# Altium schematic sheet 05 - Gate Drivers.SchDoc: Gate Drivers - 25kW WolfPACK FM3 Six-Pack Inv. (part 2 of 2)
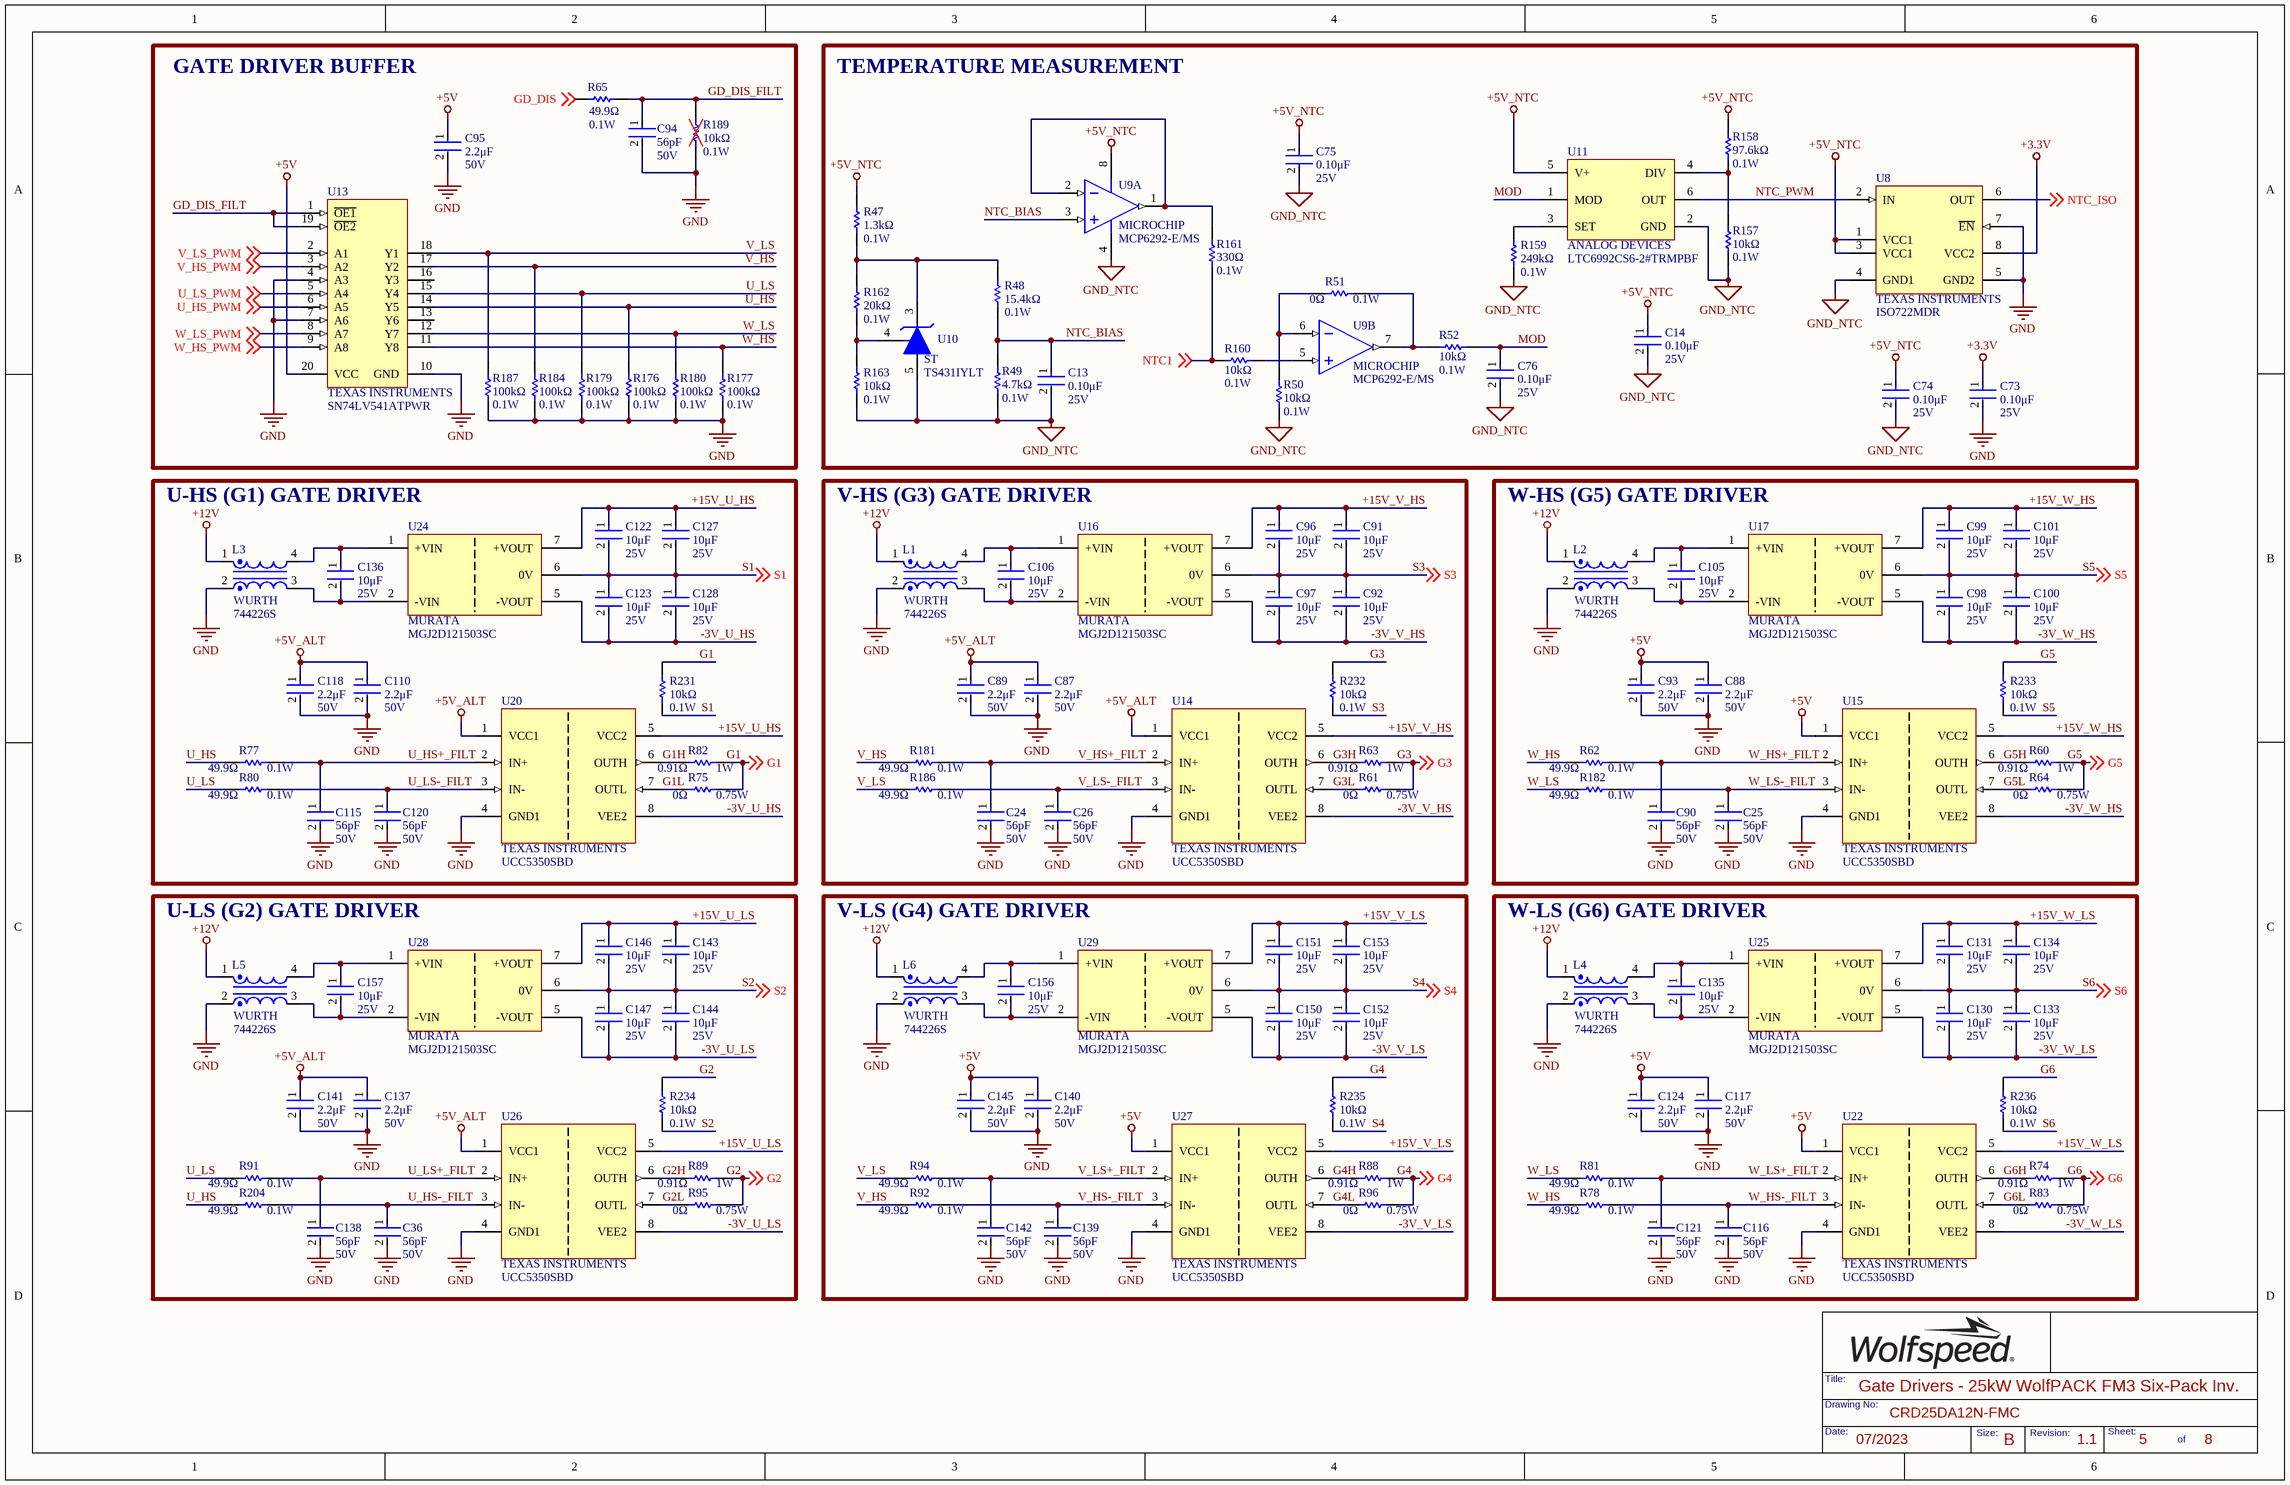
[diagram p1: 05 - Gate Drivers.SchDoc]

## Library data of the parts
C13 C14 C73-C76 = CMP-2006-03057-2: CAP CER 0.1UF 25V X7R 0603; Manufacturer: KEMET; Value: 0.10μF; Material: Ceramic; Tolerance: 0.1; Temperature Coefficient: 30ppm/°C; Automotive Grade: Grade 1; Lead Free: Yes; Device Class L3: Ceramic Capacitors; Manufacturer Part Number: C0603C104K3RACTU; Digikey Description: CAP CER 0.1UF 25V X7R 0603; Mouser Description: Multilayer Ceramic Capacitors MLCC - SMD/SMT 25volts 0.1uF X7R 10%; Package: 0603; Temperature Range Low: -55°C; Automotive: Yes; Device Class L2: Capacitors; Octopart: https://octopart.com/c0603c104k3ractu-kemet-127541; ComponentLink2Description: Datasheet; ComponentLink2URL: https://api.kemet.com/component-edge/download/datasheet/C0603C100J5GACAUTO.pdf; Temperature Range High: +125°C; RoHS: TRUE; Device Class L1: Passive Components; Category: Cap; Temperature: -55°C to +125°C; Height: 0.87mm; Temperature Characteristic: X7R
C24-C26 C36 C90 C94 C115 C116 C120 C121 C138 C139 C142 = CL10C560JB8NNNC: CAP CER 56PF 50V C0G/NP0 0603; Manufacturer: SAMSUNG; Material: Ceramic; Tolerance: 5%; Dielectric: C0G; Temperature Coefficient: 30ppm/°C; Supplier 1: Arrow Electronics; Manufacturer Part Number: CL10C560JB8NNNC; RoHS: Yes; Category: Ceramic Capacitors; Stock 1: 60182; Pricing 1: 1=0.05960, 10=0.01370, 25=0.01360, 100=0.01080, 250=0.01070, 500=0.00740, 1000=0.00590, 3000=0.00560, 6000=0.00530, 15000=0.00500, 30000=0.00470 (USD); Mount: Surface Mount; Case Code (Metric): 1608; Case Code (Imperial): 0603; Min Operating Temperature: -55°C; Max Operating Temperature: 125°C; Packaging: Tape and Reel; Package Quantity: 1; Voltage: 50V; Voltage Rating (DC): 50V; Series: CL; Construction: Flat; Termination: SMD/SMT; Length: 1.6mm; Width: 0.031inch; Height: 0.8mm; Thickness: 0.035inch; Depth: 0.8mm; Radiation Hardening: No; Lead Free: Lead Free; RoHS Compliant: Yes; ComponentLink1URL: https://datasheet.ciiva.com/25803/cl10c560jb8nnnc-25803592.pdf?src-supplier=Digi-Key; ComponentLink1Description: https://datasheet.ciiva.com/25803/cl10c560jb8nnnc-25803592.pdf?src-supplier=Digi-Key; ComponentLink2URL: https://datasheet.ciiva.com/26838/getdatasheetpartid-640760-26838546.pdf?src-supplier=Verical; ComponentLink2Description: https://datasheet.ciiva.com/26838/getdatasheetpartid-640760-26838546.pdf?src-supplier=Verical; ComponentLink3URL: https://datasheet.ciiva.com/29198/456837-da-01-en-vs-kondensator-0603-29198873.pdf?src-supplier=Conrad; ComponentLink3Description: https://datasheet.ciiva.com/29198/456837-da-01-en-vs-kondensator-0603-29198873.pdf?src-supplier=Conrad; ComponentLink4URL: https://datasheet.ciiva.com/48428/mlcc-catalogdownload2013-eng-48428598.pdf?src-supplier=Distrelec; ComponentLink4Description: https://datasheet.ciiva.com/48428/mlcc-catalogdownload2013-eng-48428598.pdf?src-supplier=Distrelec; ComponentLink5URL: https://datasheet.ciiva.com/16449/cl05b104kq5nnnc-16449527.pdf?src-supplier=Future+Electronics; ComponentLink5Description: https://datasheet.ciiva.com/16449/cl05b104kq5nnnc-16449527.pdf?src-supplier=Future+Electronics; Supplier Part Number 1: CL10C560JB8NNNC; Package: 0603; Value: 56pF
C87-C89 C93 C95 C110 C117 C118 C124 C137 C140 C141 C145 = GRT188R61H225ME13D: CAP CER 2.2UF 50V X5R 0603; Manufacturer: MURATA; Tolerance: 20%; Value: 2.2μF; Supplier 1: Arrow Electronics; Manufacturer Part Number: GRT188R61H225ME13D; RoHS: Yes; Category: Ceramic Capacitors; Stock 1: 3937; Pricing 1: 1=0.29580, 10=0.20370, 25=0.18090, 100=0.12380, 250=0.12190, 500=0.10920, 1000=0.07700, 3000=0.07630 (USD); Mount: Surface Mount; Case Code (Metric): 1608; Case Code (Imperial): 0603; Min Operating Temperature: -55°C; Max Operating Temperature: 85°C; Packaging: Tape and Reel; Length: 0.063inch; Width: 0.031inch; Thickness: 0.035inch; Ratings: AEC-Q200; RoHS Compliant: Yes; ComponentLink1URL: http://search.murata.co.jp/Ceramy/image/img/A01X/G101/ENG/GRT188R61H225ME13-01.pdf?src-supplier=Digi-Key; ComponentLink1Description: http://search.murata.co.jp/Ceramy/image/img/A01X/G101/ENG/GRT188R61H225ME13-01.pdf?src-supplier=Digi-Key; ComponentLink2URL: https://search.murata.co.jp/Ceramy/image/img/A01X/G101/ENG/GRT188R61H225ME13-01.pdf?src-supplier=Digi-Key; ComponentLink2Description: https://search.murata.co.jp/Ceramy/image/img/A01X/G101/ENG/GRT188R61H225ME13-01.pdf?src-supplier=Digi-Key; Supplier Part Number 1: GRT188R61H225ME13D; Package: 0603
C91 C92 C96-C101 C105 C106 C122 C123 C127 C128 C130 C131 C133-C136 C143 C144 C146 C147 C150-C153 C156 C157 = CMP-13271-001434-1: CAP CER 10UF 25V X7R 1206; Manufacturer: SAMSUNG; Tolerance: 10%; Value: 10μF; Max Operating Temperature: 125°C; Dielectric: X7R; Min Operating Temperature: -55°C; Height: 1.6mm; Mount: Surface Mount; Width: 0.063inch; Thickness: 0.071inch; Case Code (Metric): 3216; Contact Plating: Tin; Packaging: Tape and Reel; Package: 1206; Case Code (Imperial): 1206; Length: 0.126inch; Radiation Hardening: No; Package Quantity: 1; Depth: 1.6mm; Manufacturer Part Number: CL31B106KAHSFNE
L1-L6 = 744226S: CMC 10UH 1.6A 2LN 920 OHM SMD; Manufacturer: WURTH ELECTRONIK; Tolerance: 30%; Voltage Rating: 80V; Resistance: 80mR; Impedance: 920R; Number of Lines: 2; Test Frequency: 1kHz; Value: 10μH; Supplier 1: Rs; Manufacturer Part Number: 744226S; RoHS: Yes; Category: Common Mode Chokes; Stock 1: 1; Pricing 1: 1=2.59000, 25=2.28200, 100=2.10000, 250=1.94000, 500=1.81400 (USD); Mount: Surface Mount; Case/Package: SMD/SMT; Weight: 0.017672oz; Min Operating Temperature: -40°C; Max Operating Temperature: 125°C; Packaging: Tape and Reel; Package Quantity: 1; Series: WE-SL2; Termination: SMD/SMT; Current Rating: 1.6A; Inductance: 10uH; Current: 1.6A; DC Resistance (DCR): 80mR; Max DC Current: 1.6A; Max Current Rating: 1.6A; Length: 9.2mm; Width: 6mm; Height: 0.205inch; Lead Free: Lead Free; RoHS Compliant: Yes; Reach SVHC Compliant: Yes; ComponentLink1URL: https://datasheet.ciiva.com/12378/744226s-67907-12378330.pdf?src-supplier=Mouser; ComponentLink1Description: https://datasheet.ciiva.com/12378/744226s-67907-12378330.pdf?src-supplier=Mouser; ComponentLink2URL: https://datasheet.ciiva.com/1008/744226s-1008438.pdf?src-supplier=Digi-Key; ComponentLink2Description: https://datasheet.ciiva.com/1008/744226s-1008438.pdf?src-supplier=Digi-Key; ComponentLink3URL: https://datasheet.ciiva.com/1126/1735584-1126949.pdf?src-supplier=Element14; ComponentLink3Description: https://datasheet.ciiva.com/1126/1735584-1126949.pdf?src-supplier=Element14; ComponentLink4URL: https://datasheet.ciiva.com/6868/1696373-6868167.pdf?src-supplier=Newark; ComponentLink4Description: https://datasheet.ciiva.com/6868/1696373-6868167.pdf?src-supplier=Newark; ComponentLink5URL: https://datasheet.ciiva.com/1008/744226s-1008439.pdf?src-supplier=Digi-Key; ComponentLink5Description: https://datasheet.ciiva.com/1008/744226s-1008439.pdf?src-supplier=Digi-Key; ComponentLink6URL: https://datasheet.ciiva.com/1008/744226s-1008440.pdf?src-supplier=Digi-Key; ComponentLink6Description: https://datasheet.ciiva.com/1008/744226s-1008440.pdf?src-supplier=Digi-Key; ComponentLink7URL: https://datasheet.ciiva.com/26308/744226s-eng-tds-26308764.pdf?src-supplier=Distrelec; ComponentLink7Description: https://datasheet.ciiva.com/26308/744226s-eng-tds-26308764.pdf?src-supplier=Distrelec; ComponentLink8URL: https://datasheet.ciiva.com/48691/001087362-da-01-ml-we-sl2-stromkomp-smd-line-filter-7-de-en-48691435.pdf?src-supplier=Conrad; ComponentLink8Description: https://datasheet.ciiva.com/48691/001087362-da-01-ml-we-sl2-stromkomp-smd-line-filter-7-de-en-48691435.pdf?src-supplier=Conrad; Supplier Part Number 1: 9040408; Package: 4-PC
R47 = ERA3AEB132V: RES SMD 1.3K OHM 0.1% 1/10W 0603; Manufacturer: PANASONIC; Manufacturer Part Number: ERA-3AEB132V; Temperature Coefficient: 25ppm/°C; Voltage Rating: 75V; Max Power Dissipation: 100mW; Value: 1.3kΩ; Supplier 1: Arrow Electronics; RoHS: Yes; Category: Chip SMD Resistors; Stock 1: 2183; Pricing 1: 1=0.31630, 10=0.27230, 25=0.26980, 100=0.11100, 250=0.10990, 500=0.06700, 1000=0.04610 (USD); Mount: Surface Mount; Package: 0603; Number of Pins: 2; Contact Plating: Tin; Case Code (Metric): 1608; Case Code (Imperial): 0603; Min Operating Temperature: -55°C; Max Operating Temperature: 155°C; Tolerance: 0.1%; Resistor Type: Thin Film; Packaging: Tape and Reel; Package Quantity: 1; Number of Terminations: 2; Termination: SMD/SMT; Voltage Rating (DC): 75V; Features: Automotive AEC-Q200; Series: ERA-3A; Resistance Tolerance: 0.1%; Construction: Rectangular; Technology: THIN FILM; Length: 1.6mm; Width: 0.8mm; Height: 0.45mm; Depth: 0.8mm; Ratings: AEC-Q200; Radiation Hardening: No; Reach SVHC Compliant: Yes; Military Standard: Not; Lead Free: Lead Free; RoHS Compliant: Yes; ComponentLink1URL: https://datasheet.ciiva.com/29183/450807-da-01-en-widerstand-0603-era-29183761.pdf?src-supplier=Conrad; ComponentLink1Description: https://datasheet.ciiva.com/29183/450807-da-01-en-widerstand-0603-era-29183761.pdf?src-supplier=Conrad; ComponentLink2URL: https://datasheet.ciiva.com/6001/485442-6001669.pdf?src-supplier=Farnell; ComponentLink2Description: https://datasheet.ciiva.com/6001/485442-6001669.pdf?src-supplier=Farnell; ComponentLink3URL: https://datasheet.ciiva.com/6001/485442-6001671.pdf?src-supplier=Farnell; ComponentLink3Description: https://datasheet.ciiva.com/6001/485442-6001671.pdf?src-supplier=Farnell; ComponentLink4URL: https://datasheet.ciiva.com/48530/era-eng-tds-48530511.pdf?src-supplier=Distrelec; ComponentLink4Description: https://datasheet.ciiva.com/48530/era-eng-tds-48530511.pdf?src-supplier=Distrelec; ComponentLink5URL: https://datasheet.ciiva.com/48425/era-eng-tds-48425420.pdf?src-supplier=Distrelec; ComponentLink5Description: https://datasheet.ciiva.com/48425/era-eng-tds-48425420.pdf?src-supplier=Distrelec; ComponentLink6URL: https://datasheet.ciiva.com/24069/aoa0000ce26-197354-24069145.pdf?src-supplier=Mouser; ComponentLink6Description: https://datasheet.ciiva.com/24069/aoa0000ce26-197354-24069145.pdf?src-supplier=Mouser; ComponentLink7URL: https://datasheet.ciiva.com/30069/54aoa0000ce26-30069735.pdf?src-supplier=Onlinecomponents.com; ComponentLink7Description: https://datasheet.ciiva.com/30069/54aoa0000ce26-30069735.pdf?src-supplier=Onlinecomponents.com; Supplier Part Number 1: ERA-3AEB132V
R48 = RC1608F1542CS: RES SMD 15.4K OHM 1% 1/10W 0603; Manufacturer: SAMSUNG; Max Power Dissipation: 100mW; Temperature Coefficient: 100ppm/°C; Voltage Rating (DC): 50V; Value: 15.4kΩ; Supplier 1: Arrow Electronics; Manufacturer Part Number: RC1608F1542CS; RoHS: Yes; Category: Chip SMD Resistors; Stock 1: 200612; Pricing 1: 1=0.01730, 10=0.01350, 25=0.01280, 50=0.01230, 100=0.01180, 250=0.01140, 500=0.01090, 1000=0.01050, 3000=0.01000, 6000=0.00950, 15000=0.00910, 30000=0.00860, 75000=0.00820 (USD); Package: 0603; Case Code (Metric): 1608; Case Code (Imperial): 0603; Contact Plating: Tin; Min Operating Temperature: -55°C; Max Operating Temperature: 155°C; Tolerance: 1%; Packaging: Tape and Reel; Resistor Type: Thick Film; Package Quantity: 1; Number of Terminations: 2; Features: Moisture Resistant; Series: RC; Length: 0.063inch; Width: 0.031inch; Height: 0.022inch; Radiation Hardening: No; Lead Free: Lead Free; RoHS Compliant: Yes; ComponentLink1URL: https://datasheet.ciiva.com/26333/451155-da-01-en-widerstand-0603-26333685.pdf?src-supplier=Conrad; ComponentLink1Description: https://datasheet.ciiva.com/26333/451155-da-01-en-widerstand-0603-26333685.pdf?src-supplier=Conrad; Supplier Part Number 1: RC1608F1542CS
R49 = CRCW06034K70FKTA: RES SMD 4.7K OHM 1% 1/10W 0603; Manufacturer: VISHAY DALE; Voltage Rating: 75V; Max Power Dissipation: 100mW; Temperature Coefficient: 100ppm/°C; Value: 4.7kΩ; Supplier 1: Digi-Key; Manufacturer Part Number: CRCW06034K70FKTA; RoHS: No; Category: Chip SMD Resistors; Pricing 1: 1=0.15000, 10=0.12900, 100=0.05040, 1000=0.02111, 2500=0.01936 (USD); Package: 0603; Weight: 7.1E-05oz; Case Code (Metric): 1608; Case Code (Imperial): 0603; Contact Plating: Tin,Lead; Min Operating Temperature: -55°C; Max Operating Temperature: 155°C; Tolerance: 1%; Resistor Type: Thick Film; Package Quantity: 5000; Packaging: Tape and Reel; Number of Terminations: 2; Voltage Rating (DC): 75V; Power Dissipation: 100mW; Features: Automotive AEC-Q200; Series: CRCW; Construction: Rectangular; Length: 1.55mm; Width: 0.033inch; Height: 0.02inch; Depth: 0.85mm; Radiation Hardening: No; Lead Free: Contains Lead; Military Standard: Not; RoHS Compliant: No; ComponentLink1URL: https://datasheet.ciiva.com/9071/dcrcw-9071351.pdf?src-supplier=Avnet; ComponentLink1Description: https://datasheet.ciiva.com/9071/dcrcw-9071351.pdf?src-supplier=Avnet; ComponentLink2URL: https://datasheet.ciiva.com/2565/dcrcw-2565426.pdf?src-supplier=Digi-Key; ComponentLink2Description: https://datasheet.ciiva.com/2565/dcrcw-2565426.pdf?src-supplier=Digi-Key; Supplier Part Number 1: 541-3004-6-ND
R50 R52 R157 R160 R163 R189 R231-R236 = ERJ3EKF1002V: RES SMD 10K OHM 1% 1/10W 0603; Manufacturer: PANASONIC; Manufacturer Part Number: ERJ-3EKF1002V; Temperature Coefficient: 100ppm/°C; Power Rating: 100mW; Voltage Rating: 75V; Value: 10kΩ; Supplier 1: Rs; RoHS: Yes; Category: Chip SMD Resistors; Stock 1: 10000; Mount: Surface Mount; Package: 0603; Number of Pins: 2; Contact Plating: Tin; Case Code (Metric): 1608; Case Code (Imperial): 0603; Size Code: 0603; Min Operating Temperature: -55°C; Max Operating Temperature: 155°C; Tolerance: 1%; Resistor Type: Thick Film; Packaging: Tape and Reel; Package Quantity: 1; Number of Terminations: 2; Termination: SMD/SMT; Voltage Rating (DC): 75V; Features: Automotive AEC-Q200; Series: ERJ; Technology: THICK FILM; Resistance Tolerance: 1%; Construction: Rectangular; Length: 1.6mm; Width: 0.8mm; Height: 0.45mm; Depth: 0.8mm; Radiation Hardening: No; Reach SVHC Compliant: Yes; Military Standard: Not; Lead Free: Lead Free; RoHS Compliant: Yes; ComponentLink1URL: https://datasheet.ciiva.com/7830/aoa0000ce2-7830729.pdf?src-supplier=Element14; ComponentLink1Description: https://datasheet.ciiva.com/7830/aoa0000ce2-7830729.pdf?src-supplier=Element14; ComponentLink2URL: https://datasheet.ciiva.com/46372/1678782-46372725.pdf?src-supplier=Element14; ComponentLink2Description: https://datasheet.ciiva.com/46372/1678782-46372725.pdf?src-supplier=Element14; ComponentLink3URL: https://datasheet.ciiva.com/28514/426256-28514198.pdf?src-supplier=Element14; ComponentLink3Description: https://datasheet.ciiva.com/28514/426256-28514198.pdf?src-supplier=Element14; ComponentLink4URL: https://datasheet.ciiva.com/24070/aoa0000ce2-24070318.pdf?src-supplier=Mouser; ComponentLink4Description: https://datasheet.ciiva.com/24070/aoa0000ce2-24070318.pdf?src-supplier=Mouser; ComponentLink5URL: https://datasheet.ciiva.com/16759/70260748-16759807.pdf?src-supplier=Allied+Electronics; ComponentLink5Description: https://datasheet.ciiva.com/16759/70260748-16759807.pdf?src-supplier=Allied+Electronics; ComponentLink6URL: https://datasheet.ciiva.com/9194/aoa0000ce2-9194199.pdf?src-supplier=Avnet; ComponentLink6Description: https://datasheet.ciiva.com/9194/aoa0000ce2-9194199.pdf?src-supplier=Avnet; ComponentLink7URL: https://datasheet.ciiva.com/48530/aoa0000ce2-48530988.pdf?src-supplier=Avnet; ComponentLink7Description: https://datasheet.ciiva.com/48530/aoa0000ce2-48530988.pdf?src-supplier=Avnet; ComponentLink8URL: https://datasheet.ciiva.com/30208/aoa0000ce2-30208985.pdf?src-supplier=Onlinecomponents.com; ComponentLink8Description: https://datasheet.ciiva.com/30208/aoa0000ce2-30208985.pdf?src-supplier=Onlinecomponents.com; Supplier Part Number 1: 1051156
R51 = CRCW06030000Z0EB: RES SMD 0 OHM JUMPER 1/10W 0603; Manufacturer: VISHAY DALE; Manufacturer Part Number: CRCW06030000Z0EBC; Max Power Dissipation: 100mW; Voltage Rating: 75V; Tolerance: 1%; Temperature Coefficient: 100ppm/°C; Value: 0Ω; Supplier 1: Newark; RoHS: Yes; Category: Chip SMD Resistors; Stock 1: 110000; Pricing 1: 1=0.00300, 10000=0.00300 (USD); Package: 0603; Number of Pins: 2; Case Code (Imperial): 0603; Case Code (Metric): 1608; Weight: 7.1E-05oz; Contact Plating: Tin; Size Code: 0603; Min Operating Temperature: -55°C; Max Operating Temperature: 155°C; Packaging: Tape and Reel; Resistor Type: Thick Film; Number of Terminations: 2; Features: Automotive AEC-Q200; Package Quantity: 10000; Termination: SMD/SMT; Voltage Rating (DC): 75V; Series: CRCW; Construction: Rectangular; Technology: THICK FILM; Length: 1.55mm; Width: 0.033inch; Height: 0.45mm; Depth: 0.85mm; Ratings: AEC-Q200; Radiation Hardening: No; RoHS Compliant: Yes; Lead Free: Lead Free; Military Standard: Not; ComponentLink1URL: https://datasheet.ciiva.com/11808/0900766b80d98afc-11808678.pdf?src-supplier=Rs; ComponentLink1Description: https://datasheet.ciiva.com/11808/0900766b80d98afc-11808678.pdf?src-supplier=Rs; ComponentLink2URL: https://datasheet.ciiva.com/2563/dcrcwe3-2563949.pdf?src-supplier=Digi-Key; ComponentLink2Description: https://datasheet.ciiva.com/2563/dcrcwe3-2563949.pdf?src-supplier=Digi-Key; ComponentLink3URL: https://datasheet.ciiva.com/5550/dcrcwe3-109170-5550748.pdf?src-supplier=Mouser; ComponentLink3Description: https://datasheet.ciiva.com/5550/dcrcwe3-109170-5550748.pdf?src-supplier=Mouser; ComponentLink4URL: https://datasheet.ciiva.com/16430/dcrcwe3-16430060.pdf?src-supplier=Future+Electronics; ComponentLink4Description: https://datasheet.ciiva.com/16430/dcrcwe3-16430060.pdf?src-supplier=Future+Electronics; ComponentLink5URL: https://datasheet.ciiva.com/7791/dcrcwe3-7791992.pdf?src-supplier=Element14; ComponentLink5Description: https://datasheet.ciiva.com/7791/dcrcwe3-7791992.pdf?src-supplier=Element14; Supplier Part Number 1: 48P7902
R60 R63 R74 R82 R88 R89 = CMP-2005-02198-1: RES 0.91 OHM 1% 1W 1210; Manufacturer: VISHAY DALE; Part Number: RCWE1210R910FKEA; Manufacturer Part Number: RCWE1210R910FKEA; Package: 1210
R61 R64 R75 R83 R95 R96 = CRCW12100000Z0EAHP: RES SMD 0 OHM JUMPER 3/4W 1210; Manufacturer: VISHAY DALE; Max Power Dissipation: 750mW; Supplier 1: Mouser; Manufacturer Part Number: CRCW12100000Z0EAHP; RoHS: Yes; Category: Chip SMD Resistors; Stock 1: 904; Pricing 1: 1=0.7, 10=0.535, 50=0.535, 100=0.225, 1000=0.135, 10000=0.134 (USD); Package: 1210; Weight: 0.000564oz; Case Code (Imperial): 1210; Case Code (Metric): 3225; Min Operating Temperature: -55°C; Max Operating Temperature: 155°C; Packaging: Tape and Reel; Package Quantity: 10; Resistance: 0Ω; Termination: SMD/SMT; Number of Terminations: 2; Features: Automotive AEC-Q200; Series: CRCW-HP; Length: 0.126inch; Width: 0.098inch; Height: 0.028inch; Radiation Hardening: No; Lead Free: Lead Free; RoHS Compliant: Yes; ComponentLink1URL: https://datasheet.ciiva.com/2477/crcwhpe3-2477993.pdf?src-supplier=Digi-Key; ComponentLink1Description: https://datasheet.ciiva.com/2477/crcwhpe3-2477993.pdf?src-supplier=Digi-Key; ComponentLink2URL: https://datasheet.ciiva.com/2477/crcwhpe3-2477991.pdf?src-supplier=Digi-Key; ComponentLink2Description: https://datasheet.ciiva.com/2477/crcwhpe3-2477991.pdf?src-supplier=Digi-Key; ComponentLink3URL: https://datasheet.ciiva.com/2477/crcwhpe3-2477992.pdf?src-supplier=Digi-Key; ComponentLink3Description: https://datasheet.ciiva.com/2477/crcwhpe3-2477992.pdf?src-supplier=Digi-Key; ComponentLink4URL: https://datasheet.ciiva.com/9109/crcwhpe3-9109997.pdf?src-supplier=Avnet; ComponentLink4Description: https://datasheet.ciiva.com/9109/crcwhpe3-9109997.pdf?src-supplier=Avnet; ComponentLink5URL: https://datasheet.ciiva.com/48527/crcwhpe3-48527662.pdf?src-supplier=Avnet; ComponentLink5Description: https://datasheet.ciiva.com/48527/crcwhpe3-48527662.pdf?src-supplier=Avnet; Supplier Part Number 1: 71-CRCW12100000Z0EAH
R62 R65 R77 R78 R80 R81 R91 R92 R94 R181 R182 R186 R204 = ERJ-3EKF49R9V: RES SMD 49.9 OHM 1% 1/10W 0603; Manufacturer: PANASONIC; Temperature Coefficient: 100ppm/°C; Voltage Rating: 75V; Max Power Dissipation: 100mW; Voltage Rating (DC): 50V; Working Voltage: 6V; Value: 49.9Ω; Supplier 1: Newark; Manufacturer Part Number: ERJ-3EKF49R9V; RoHS: Yes; Category: Chip SMD Resistors; Stock 1: 670000; Pricing 1: 1=0.00600, 5000=0.00600 (USD); Mount: Surface Mount; Contact Plating: Tin; Case Code (Imperial): 0603; Case Code (Metric): 1608; Min Operating Temperature: -55°C; Max Operating Temperature: 155°C; Tolerance: 1%; Resistor Type: Thick Film; Packaging: Tape and Reel; Package Quantity: 5000; Number of Terminations: 2; Termination: SMD/SMT; Features: Automotive AEC-Q200; Series: ERJ; Resistance Tolerance: 1%; Construction: Rectangular; Technology: THICK FILM; Length: 1.6mm; Width: 0.8mm; Height: 0.022inch; Depth: 0.8mm; Radiation Hardening: No; Reach SVHC Compliant: Yes; Military Standard: Not; Lead Free: Lead Free; RoHS Compliant: Yes; ComponentLink1URL: https://datasheet.ciiva.com/46388/1678782-46388908.pdf?src-supplier=Element14; ComponentLink1Description: https://datasheet.ciiva.com/46388/1678782-46388908.pdf?src-supplier=Element14; ComponentLink2URL: https://datasheet.ciiva.com/28694/1678782-28694219.pdf?src-supplier=Element14; ComponentLink2Description: https://datasheet.ciiva.com/28694/1678782-28694219.pdf?src-supplier=Element14; ComponentLink3URL: https://datasheet.ciiva.com/16772/70260748-16772570.pdf?src-supplier=Allied+Electronics; ComponentLink3Description: https://datasheet.ciiva.com/16772/70260748-16772570.pdf?src-supplier=Allied+Electronics; ComponentLink4URL: https://datasheet.ciiva.com/16766/70260748-16766262.pdf?src-supplier=Allied+Electronics; ComponentLink4Description: https://datasheet.ciiva.com/16766/70260748-16766262.pdf?src-supplier=Allied+Electronics; ComponentLink5URL: https://datasheet.ciiva.com/9117/aoa0000ce2-9117128.pdf?src-supplier=Avnet; ComponentLink5Description: https://datasheet.ciiva.com/9117/aoa0000ce2-9117128.pdf?src-supplier=Avnet; ComponentLink6URL: https://datasheet.ciiva.com/48531/aoa0000ce2-48531019.pdf?src-supplier=Avnet; ComponentLink6Description: https://datasheet.ciiva.com/48531/aoa0000ce2-48531019.pdf?src-supplier=Avnet; ComponentLink7URL: https://datasheet.ciiva.com/30095/aoa0000ce2-30095355.pdf?src-supplier=Onlinecomponents.com; ComponentLink7Description: https://datasheet.ciiva.com/30095/aoa0000ce2-30095355.pdf?src-supplier=Onlinecomponents.com; Supplier Part Number 1: 12AC1058; Package: 0603
R158 = ERJ-3EKF9762V: RES SMD 97.6K OHM 1% 1/10W 0603; Manufacturer: PANASONIC; Temperature Coefficient: 100ppm/°C; Voltage Rating: 75V; Power Rating: 100mW; Voltage Rating (DC): 50V; Value: 97.6kΩ; Supplier 1: Newark; Manufacturer Part Number: ERJ-3EKF9762V; RoHS: Yes; Category: Chip SMD Resistors; Stock 1: 50000; Pricing 1: 5000=0.01600, 10000=0.01600, 20000=0.01600, 30000=0.01600, 50000=0.01400 (USD); Mount: Surface Mount; Package: 0603; Contact Plating: Tin; Case Code (Metric): 1608; Case Code (Imperial): 0603; Min Operating Temperature: -55°C; Max Operating Temperature: 155°C; Tolerance: 1%; Resistor Type: Thick Film; Packaging: Tape and Reel; Package Quantity: 1; Number of Terminations: 2; Termination: SMD/SMT; Features: Automotive AEC-Q200; Series: ERJ; Resistance Tolerance: 1%; Construction: Rectangular; Technology: THICK FILM; Length: 1.6mm; Width: 0.8mm; Height: 0.45mm; Depth: 0.8mm; Radiation Hardening: No; Reach SVHC Compliant: Yes; Military Standard: Not; RoHS Compliant: Yes; ComponentLink1URL: https://datasheet.ciiva.com/7937/1678782-7937451.pdf?src-supplier=Element14; ComponentLink1Description: https://datasheet.ciiva.com/7937/1678782-7937451.pdf?src-supplier=Element14; ComponentLink2URL: https://datasheet.ciiva.com/46420/1678782-46420270.pdf?src-supplier=Element14; ComponentLink2Description: https://datasheet.ciiva.com/46420/1678782-46420270.pdf?src-supplier=Element14; ComponentLink3URL: https://datasheet.ciiva.com/24023/aoa0000ce2-24023438.pdf?src-supplier=Mouser; ComponentLink3Description: https://datasheet.ciiva.com/24023/aoa0000ce2-24023438.pdf?src-supplier=Mouser; ComponentLink4URL: https://datasheet.ciiva.com/16770/70260748-16770055.pdf?src-supplier=Allied+Electronics; ComponentLink4Description: https://datasheet.ciiva.com/16770/70260748-16770055.pdf?src-supplier=Allied+Electronics; ComponentLink5URL: https://datasheet.ciiva.com/16762/70260748-16762984.pdf?src-supplier=Allied+Electronics; ComponentLink5Description: https://datasheet.ciiva.com/16762/70260748-16762984.pdf?src-supplier=Allied+Electronics; ComponentLink6URL: https://datasheet.ciiva.com/9186/aoa0000ce2-9186837.pdf?src-supplier=Avnet; ComponentLink6Description: https://datasheet.ciiva.com/9186/aoa0000ce2-9186837.pdf?src-supplier=Avnet; ComponentLink7URL: https://datasheet.ciiva.com/9186/aoa0000ce2-9186841.pdf?src-supplier=Avnet; ComponentLink7Description: https://datasheet.ciiva.com/9186/aoa0000ce2-9186841.pdf?src-supplier=Avnet; Supplier Part Number 1: 27AC5274
R159 = RMCF0603FT249K: RES 249K OHM 1% 1/10W 0603; Manufacturer: STACKPOLE; Temperature Coefficient: 100ppm/°C; Value: 249kΩ; Supplier 1: Avnet; Manufacturer Part Number: RMCF0603FT249K; RoHS: Yes; Category: Chip SMD Resistors; Stock 1: 30000; Pricing 1: 5000=0.00280, 10000=0.00276, 20000=0.00272, 30000=0.00268, 40000=0.00264, 50000=0.00260, 500000=0.00256 (USD); Mount: Surface Mount; Package: 0603; Case Code (Metric): 1608; Case Code (Imperial): 0603; Contact Plating: Tin,Matte; Min Operating Temperature: -55°C; Max Operating Temperature: 155°C; Packaging: Tape and Reel; Tolerance: 1%; Series: RMCF; Resistor Type: Thick Film; Number of Terminations: 2; Features: Automotive AEC-Q200; Length: 0.061inch; Width: 0.031inch; Height: 0.022inch; Radiation Hardening: No; RoHS Compliant: Yes; Lead Free: Lead Free; ComponentLink1URL: https://www.seielect.com/catalog/SEI-Packaging.pdf?src-supplier=Digi-Key; ComponentLink1Description: https://www.seielect.com/catalog/SEI-Packaging.pdf?src-supplier=Digi-Key; ComponentLink2URL: https://www.seielect.com/Catalog/SEI-RMCF_RMCP.pdf?src-supplier=Digi-Key; ComponentLink2Description: https://www.seielect.com/Catalog/SEI-RMCF_RMCP.pdf?src-supplier=Digi-Key; ComponentLink3URL: https://www.seielect.com/catalog/SEI-RMCF_RMCP.pdf?src-supplier=Avnet; ComponentLink3Description: https://www.seielect.com/catalog/SEI-RMCF_RMCP.pdf?src-supplier=Avnet; Supplier Part Number 1: RMCF0603FT249K
R161 = RC0603FR-13330RL: RES 330 OHM 1% 1/10W 0603; Manufacturer: YAGEO; Voltage Rating: 50V; Temperature Coefficient: 100ppm/°C; Value: 330Ω; Supplier 1: Future Electronics; Manufacturer Part Number: RC0603FR-13330RL; RoHS: Yes; Category: Chip SMD Resistors; Stock 1: 560000; Pricing 1: 20000=0.00130, 80000=0.00120, 400000=0.00120, 800000=0.00110, 2500000=0.00110 (USD); Package: 0603; Case Code (Imperial): 0603; Case Code (Metric): 1608; Min Operating Temperature: -55°C; Max Operating Temperature: 155°C; Tolerance: 1%; Packaging: Tape and Reel; Resistor Type: Thick Film; Termination: SMD/SMT; Series: RC; Construction: Rectangular; Length: 1.6mm; Width: 0.8mm; Height: 0.45mm; Depth: 0.8mm; Military Standard: Not; RoHS Compliant: Yes; ComponentLink1URL: https://datasheet.ciiva.com/12561/rc0603-272842-12561430.pdf?src-supplier=Mouser; ComponentLink1Description: https://datasheet.ciiva.com/12561/rc0603-272842-12561430.pdf?src-supplier=Mouser; Supplier Part Number 1: 4067719
R162 = CRCW060320K0FKTA: RES SMD 20K OHM 1% 1/10W 0603; Manufacturer: VISHAY DALE; Temperature Coefficient: 100ppm/°C; Voltage Rating: 75V; Max Power Dissipation: 100mW; Value: 20kΩ; Supplier 1: Arrow Electronics; Manufacturer Part Number: CRCW060320K0FKTA; RoHS: No; Category: Chip SMD Resistors; Stock 1: 8; Pricing 1: 1=0.14090 (USD); Package: 0603; Number of Pins: 2; Contact Plating: Tin,Lead; Weight: 7.1E-05oz; Case Code (Metric): 1608; Case Code (Imperial): 0603; Min Operating Temperature: -55°C; Max Operating Temperature: 155°C; Tolerance: 1%; Resistor Type: Thick Film; Package Quantity: 5000; Packaging: Tape and Reel; Number of Terminations: 2; Termination: SMD/SMT; Power Dissipation: 100mW; Voltage Rating (DC): 75V; Features: Automotive AEC-Q200; Series: CRCW; Construction: Rectangular; Resistance Tolerance: 1%; Length: 1.55mm; Width: 0.033inch; Height: 0.02inch; Depth: 0.85mm; Radiation Hardening: No; Lead Free: Contains Lead; Military Standard: Not; RoHS Compliant: No; ComponentLink1URL: https://datasheet.ciiva.com/3883/dcrcw-3883254.pdf?src-supplier=Arrow+Electronics; ComponentLink1Description: https://datasheet.ciiva.com/3883/dcrcw-3883254.pdf?src-supplier=Arrow+Electronics; ComponentLink2URL: https://datasheet.ciiva.com/26933/getdatasheetpartid-28850-26933811.pdf?src-supplier=Verical; ComponentLink2Description: https://datasheet.ciiva.com/26933/getdatasheetpartid-28850-26933811.pdf?src-supplier=Verical; ComponentLink3URL: https://datasheet.ciiva.com/9033/dcrcw-9033436.pdf?src-supplier=Avnet; ComponentLink3Description: https://datasheet.ciiva.com/9033/dcrcw-9033436.pdf?src-supplier=Avnet; ComponentLink4URL: https://datasheet.ciiva.com/2565/dcrcw-2565123.pdf?src-supplier=Digi-Key; ComponentLink4Description: https://datasheet.ciiva.com/2565/dcrcw-2565123.pdf?src-supplier=Digi-Key; Supplier Part Number 1: CRCW060320K0FKTA
R176 R177 R179 R180 R184 R187 = RC0603FR-07100KL: RES 100K OHM 1% 1/10W 0603; Manufacturer: YAGEO; Temperature Coefficient: 100ppm/°C; Voltage Rating: 50V; Working Voltage: 75V; Max Power Dissipation: 100mW; Value: 100kΩ; Supplier 1: Future Electronics; Manufacturer Part Number: RC0603FR-07100KL; RoHS: Yes; Category: Chip SMD Resistors; Stock 1: 39805000; Pricing 1: 5000=0.00150, 50000=0.00140, 200000=0.00140, 625000=0.00130, 2000000=0.00120 (USD); Package: 0603; Number of Pins: 2; Case Code (Imperial): 0603; Case Code (Metric): 1608; Min Operating Temperature: -55°C; Max Operating Temperature: 155°C; Tolerance: 1%; Resistor Type: Thick Film; Voltage Rating (DC): 50V; Packaging: Tape and Reel; Termination: SMD/SMT; Number of Terminations: 2; Features: Moisture Resistant; Series: RC; Resistance Tolerance: 1%; Construction: Rectangular; Technology: THICK FILM; Length: 1.6mm; Width: 0.8mm; Height: 0.45mm; Depth: 0.8mm; Reach SVHC Compliant: Yes; Military Standard: Not; Lead Free: Lead Free; RoHS Compliant: Yes; ComponentLink1URL: https://datasheet.ciiva.com/11808/0900766b80f96399-11808107.pdf?src-supplier=Rs; ComponentLink1Description: https://datasheet.ciiva.com/11808/0900766b80f96399-11808107.pdf?src-supplier=Rs; ComponentLink2URL: https://datasheet.ciiva.com/7983/443971-7983593.pdf?src-supplier=Element14; ComponentLink2Description: https://datasheet.ciiva.com/7983/443971-7983593.pdf?src-supplier=Element14; ComponentLink3URL: https://datasheet.ciiva.com/22747/443971-22747516.pdf?src-supplier=Element14; ComponentLink3Description: https://datasheet.ciiva.com/22747/443971-22747516.pdf?src-supplier=Element14; ComponentLink4URL: https://datasheet.ciiva.com/46440/1868787-46440889.pdf?src-supplier=Element14; ComponentLink4Description: https://datasheet.ciiva.com/46440/1868787-46440889.pdf?src-supplier=Element14; ComponentLink5URL: https://datasheet.ciiva.com/7746/1738695-7746235.pdf?src-supplier=Element14; ComponentLink5Description: https://datasheet.ciiva.com/7746/1738695-7746235.pdf?src-supplier=Element14; ComponentLink6URL: https://datasheet.ciiva.com/7746/1738695-7746234.pdf?src-supplier=Element14; ComponentLink6Description: https://datasheet.ciiva.com/7746/1738695-7746234.pdf?src-supplier=Element14; Supplier Part Number 1: 3697448
U8 = CMP-0328-00055-4: DGTL ISO 2500VRMS 1CH GP 8SOIC; TTL/CMOS Input Threshold: CMOS; Prop Delay(Max)(ns): 16; Input Noise Filter: None; Insulation Rating(VRMS): 2500; Datarate(Mbps): 150; Eco-Plan: Green (RoHS & no Sb/Br); Rating: Catalog; Supply Voltage(s)(V): 3.3, 5; SubFamily: Isolator; Thermal Shutdown: No; ComponentLink3Description: URL Link1; PackageDescription: 8-Pin Plastic Small Outline Integrated Circuit, 4.9 x 3.9 mm, Pitch 1.27 mm Pitch; ComponentLink3URL: SamplesURL:http://www.ti.com/product/iso722m#samples; Manufacturer Part Number: ISO722MDR; Channel Configuration: 1/01/2000; ComponentLink1URL: http://www.ti.com/; PackageReference: D0008B; Mounting Technology: Surface Mount; PackageVersion: revM, Jun-2011; ComponentLink1Description: Manufacturer URL; ComponentLink2URL: http://www.ti.com/general/docs/lit/getliterature.tsp?genericPartNumber=ISO722M&fileType=pdf; ComponentLink2Description: Datasheet; DatasheetVersion: SLLS629J; Package: 8-SOIC; Value: N/A
U9 = MCP6292-E/MS: IC OPAMP GP 2 CIRCUIT 8MSOP; Number of Channels: 2; Max Supply Voltage: 5.5V; Unity Gain Bandwidth Product: 10MHz; Slew Rate: 7V/µs; Common Mode Rejection Ratio: 70dB; Min Supply Voltage: 2.4V; Voltage Gain: 110dB; Output Current: 25mA; Nominal Supply Current: 1mA; Input Bias Current: 1pA; Input Offset Voltage (Vos): 3mV; Amplifier Type: GENERAL PURPOSE; Input Offset Voltage-Max: 5mV; Supplier 1: Newark; Manufacturer: MICROCHIP; Manufacturer Part Number: MCP6292-E/MS; RoHS: Yes; Category: Amplifiers - Op Amps, Buffer, Instrumentation; Stock 1: 1446; Pricing 1: 1=1.08000, 10=0.99600, 25=0.91100, 50=0.86900, 100=0.82600 (USD); Mount: Surface Mount; Case/Package: MSOP; Number of Pins: 8; Min Operating Temperature: -40°C; Max Operating Temperature: 125°C; Packaging: Rail/Tube; Bandwidth: 10MHz; Number of Circuits: 2; Gain Bandwidth Product: 10MHz; Number of Elements: 2; Power Supply Rejection Ratio (PSRR): 70dB; Number of Amplifiers: 2; Supply Current: 1mA; Technology: CMOS; Package Quantity: 100; Operating Supply Current: 1mA; Output Current per Channel: 25mA; Slew Rate-Nom: 7V/µs; Length: 3mm; Width: 3mm; Height: 0.85mm; Radiation Hardening: No; Reach SVHC Compliant: Yes; Lead Free: Lead Free; RoHS Compliant: Yes; ComponentLink1URL: https://datasheet.ciiva.com/8078/809135-8078950.pdf?src-supplier=Element14; ComponentLink1Description: https://datasheet.ciiva.com/8078/809135-8078950.pdf?src-supplier=Element14; ComponentLink2URL: https://datasheet.ciiva.com/11710/21812e-11710232.pdf?src-supplier=Avnet; ComponentLink2Description: https://datasheet.ciiva.com/11710/21812e-11710232.pdf?src-supplier=Avnet; ComponentLink3URL: https://datasheet.ciiva.com/26947/getdatasheetpartid-442666-26947846.pdf?src-supplier=Verical; ComponentLink3Description: https://datasheet.ciiva.com/26947/getdatasheetpartid-442666-26947846.pdf?src-supplier=Verical; ComponentLink4URL: https://datasheet.ciiva.com/1793/21812e-1793844.pdf?src-supplier=Digi-Key; ComponentLink4Description: https://datasheet.ciiva.com/1793/21812e-1793844.pdf?src-supplier=Digi-Key; Supplier Part Number 1: 20T6022; Package: 8-MSOP; Value: N/A
U10 = TS431IYLT: IC VREF SHUNT ADJ 2% SOT23-5; Manufacturer: STMICROELECTRONICS; Output Voltage: 6V; Max Input Voltage: 10V; Max Output Current: 30mA; Reference Type: Shunt,Adjustable; Number of Channels: 1; Temperature Coefficient: 100ppm/°C; Cathode Current: 60uA; Output Type: Adjustable; Min Output Voltage: 1.24V; Supplier 1: Avnet; Manufacturer Part Number: TS431IYLT; RoHS: Yes; Category: Voltage References; Stock 1: 15000; Pricing 1: 3000=0.25181, 6000=0.24861, 12000=0.24434, 18000=0.23794, 24000=0.23581 (USD); Mount: Surface Mount; Case/Package: SOT-23-5; Number of Pins: 5; Min Operating Temperature: -40°C; Max Operating Temperature: 125°C; Package Quantity: 1; Tolerance: 2%; Packaging: Tape and Reel; Output Current: 30mA; Max Output Voltage: 6V; Series: Automotive, AEC-Q100; Radiation Hardening: No; RoHS Compliant: Yes; ComponentLink1URL: https://datasheet.ciiva.com/2006/cd00001336-2006390.pdf?src-supplier=Digi-Key; ComponentLink1Description: https://datasheet.ciiva.com/2006/cd00001336-2006390.pdf?src-supplier=Digi-Key; ComponentLink2URL: https://datasheet.ciiva.com/2006/cd00001336-2006391.pdf?src-supplier=Digi-Key; ComponentLink2Description: https://datasheet.ciiva.com/2006/cd00001336-2006391.pdf?src-supplier=Digi-Key; ComponentLink3URL: https://datasheet.ciiva.com/2006/cd00001336-2006392.pdf?src-supplier=Digi-Key; ComponentLink3Description: https://datasheet.ciiva.com/2006/cd00001336-2006392.pdf?src-supplier=Digi-Key; Supplier Part Number 1: TS431IYLT; Value: N/A; Package: SOT-23-5
U11 = LTC6992CS6-2#TRMPBF: IC OSC SILICON PROG TSOT23-6; Frequency: 3.81Hz; Min Supply Voltage: 2.25V; Max Supply Voltage: 5.5V; Number of Timers/Counters: 1; Operating Supply Current: 365uA; Supplier 1: Digi-Key; Manufacturer: ANALOG DEVICES; Manufacturer Part Number: LTC6992CS6-2#TRMPBF; RoHS: Yes; Category: Clock and Timing; Pricing 1: 1=5.53000, 10=4.97000, 25=4.69840, 100=4.07200, 250=3.86316 (USD); Mount: Surface Mount; Package: TSOT-23-6; Number of Pins: 6; Min Operating Temperature: 0°C; Max Operating Temperature: 70°C; Packaging: Cut Tape; Package Quantity: 1; Series: TimerBlox®; Length: 2.9mm; Depth: 1.75mm; Reach SVHC Compliant: Yes; RoHS Compliant: Yes; ComponentLink1URL: https://datasheet.ciiva.com/1233/29337-1233009.pdf?src-supplier=Digi-Key; ComponentLink1Description: https://datasheet.ciiva.com/1233/29337-1233009.pdf?src-supplier=Digi-Key; ComponentLink2URL: https://datasheet.ciiva.com/1233/29337-1233010.pdf?src-supplier=Digi-Key; ComponentLink2Description: https://datasheet.ciiva.com/1233/29337-1233010.pdf?src-supplier=Digi-Key; ComponentLink3URL: https://datasheet.ciiva.com/1233/29337-1233011.pdf?src-supplier=Digi-Key; ComponentLink3Description: https://datasheet.ciiva.com/1233/29337-1233011.pdf?src-supplier=Digi-Key; ComponentLink4URL: https://datasheet.ciiva.com/1142/1441932-1142139.pdf?src-supplier=Farnell; ComponentLink4Description: https://datasheet.ciiva.com/1142/1441932-1142139.pdf?src-supplier=Farnell; ComponentLink5URL: https://datasheet.ciiva.com/1142/1441932-1142140.pdf?src-supplier=Farnell; ComponentLink5Description: https://datasheet.ciiva.com/1142/1441932-1142140.pdf?src-supplier=Farnell; ComponentLink6URL: https://datasheet.ciiva.com/1139/1642034-1139621.pdf?src-supplier=Element14; ComponentLink6Description: https://datasheet.ciiva.com/1139/1642034-1139621.pdf?src-supplier=Element14; ComponentLink7URL: https://datasheet.ciiva.com/48709/001253668-da-01-en-ic-osc-ltc6992cs6-2-trmpbf-tsot-23-6-ltc-48709100.pdf?src-supplier=Conrad; ComponentLink7Description: https://datasheet.ciiva.com/48709/001253668-da-01-en-ic-osc-ltc6992cs6-2-trmpbf-tsot-23-6-ltc-48709100.pdf?src-supplier=Conrad; Supplier Part Number 1: 505-LTC6992CS6-2#TRMPBFDKR-ND; Value: N/A
U13 = CMP-0440-01163-3: IC BUF NON-INVERT 5.5V 20TSSOP; Bits(#): 8; Voltage(Nom)(V): 5; ICC @ Nom Voltage(Max)(mA): 0.02; VCC(Max)(V): 5.5; Output Type: CMOS; Rating: Catalog; Input Type: TTL; VCC(Min)(V): 4.5; F @ Nom Voltage(Max)(Mhz): 110; tpd @ Nom Voltage(Max)(ns): 7.9; Code_JEDEC: MO-153; PackageReference: PW0020A; DatasheetVersion: SCES573B; Generic Part Number: SN74LV541AT; Operating Temperature Range(C): -40 to 125; PackageVersion: http://www.ti.com/lit/ml/mpds362/mpds362.pdf; Package: 20-TSSOP; Value: N/A; Manufacturer Part Number: SN74LV541ATPWR
U14 U15 U20 U22 U26 U27 = UCC5350SBD: 5A/5A, 3-KVRMS SINGLE-CHANNEL IS; Class: U; Working Voltage: 990V; Number of Channels: 1; Type: DEV; RefDes: RefDes; Copyright: Copyright (C) 2021 Ultra Librarian. All rights reserved.; Mfr_Name: Texas Instruments; Manufacturer_Part_Number: UCC5350SBD; Digi-Key_Part_Number_1: 296-47508-ND; Supplier 1: Digi-Key; Manufacturer: TEXAS INSTRUMENTS; Manufacturer Part Number: UCC5350SBD; RoHS: Yes; Category: Integrated Circuits (ICs); Stock 1: 1; Pricing 1: 1=3.15000, 10=2.83100, 25=2.67600, 100=2.31920, 250=2.20024, 500=1.97428, 1000=1.68300 (USD); Min Operating Temperature: -40°C; Max Operating Temperature: 125°C; RoHS Compliant: Yes; ComponentLink1URL: http://www.ti.com/lit/ds/symlink/ucc5350sb.pdf?src-supplier=Farnell; ComponentLink1Description: http://www.ti.com/lit/ds/symlink/ucc5350sb.pdf?src-supplier=Farnell; ComponentLink2URL: http://www.ti.com/lit/ds/symlink/ucc5350.pdf?src-supplier=Digi-Key; ComponentLink2Description: http://www.ti.com/lit/ds/symlink/ucc5350.pdf?src-supplier=Digi-Key; Supplier Part Number 1: 296-47508-ND; Package: 8-SOIC; Value: N/A
U16 U17 U24 U25 U28 U29 = MGJ2D121503SC: DC DC CONVERTER 15V -3V 1.7W; Supplier 1: Mouser; Manufacturer: MURATA; Manufacturer Part Number: MGJ2D121503SC; RoHS: Yes; Category: Board Mount Modules; Stock 1: 14; Pricing 1: 1=8.68000, 10=8.68000, 50=8.67000, 100=8.33000, 1000=8.00000, 10000=8.00000 (USD); Supplier Part Number 1: 580-MGJ2D121503SC; Value: N/A; Package: 7-SIP